# EAGLE schematic Badge_Motor (EAGLE 6.3)
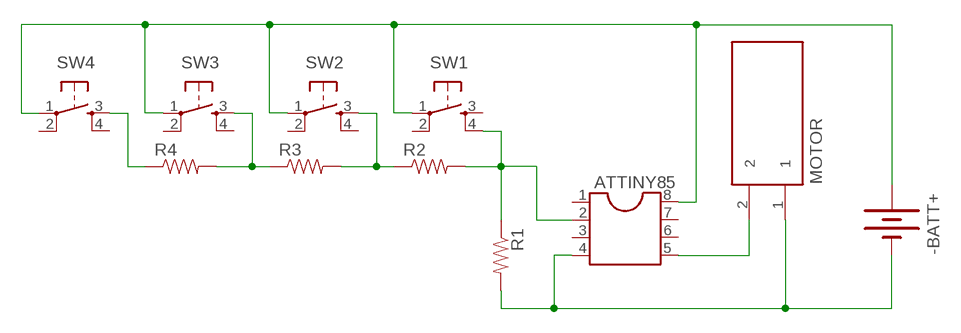
[diagram p0: schematic, sheet 1]

## Parts
-BATT+  BATTERY245MM  [BATTCON_245MM]
ATTINY85  DIL8S  [SOCKET-08]
MOTOR  VIB-MOTOR  [VIB-MOTOR]
R1  RESISTOR2010  [R2010]
R2  RESISTOR2010  [R2010]
R3  RESISTOR2010  [R2010]
R4  RESISTOR2010  [R2010]
SW1  TAC_SWITCHPTH  [TACTILE-PTH]
SW2  TAC_SWITCHPTH  [TACTILE-PTH]
SW3  TAC_SWITCHPTH  [TACTILE-PTH]
SW4  TAC_SWITCHPTH  [TACTILE-PTH]

## Nets
+3V: -BATT+.1(+) ATTINY85.8 SW1.1 SW2.1 SW3.1 SW4.1
GND: -BATT+.2(-) ATTINY85.4 MOTOR.1 R1.2
N$1: ATTINY85.5 MOTOR.2
N$4: ATTINY85.2 R1.1 R2.2 SW1.4
N$17: R4.1 SW4.3
N$18: R3.1 R4.2 SW3.3
N$19: R2.1 R3.2 SW2.3
Unconnected: ATTINY85.1 ATTINY85.3 ATTINY85.6 ATTINY85.7 SW1.2 SW1.3 SW2.2 SW2.4 SW3.2 SW3.4 SW4.2 SW4.4

## Library data of the parts
-BATT+ = SparkFun:BATTERY: Battery Holders Various common sizes : AA, AAA, 20mm coin cell and 12mm coin cell.
ATTINY85 = ic-package:DIL8: Dual In Line / Socket
MOTOR = JeffThompson:VIB-MOTOR
R1-R4 = SparkFun:RESISTOR: Resistor Basic schematic elements and footprints for 0603, 1206, and PTH resistors.
SW1-SW4 = SparkFun:TAC_SWITCH: Momentary Switch Button commonly used for reset or general input. Spark Fun Electronics SKU : COM-00097